# EasyEDA Pro project 2(1).eprj

# Schematic Schematic1
Create Date: 2024-12-19; Page Name: P1; Project Name: 2; Schematic Name: Schematic1; Update Date: 2024-12-19; Company: 嘉立创EDA; Page Size: A4; Version: V1.0
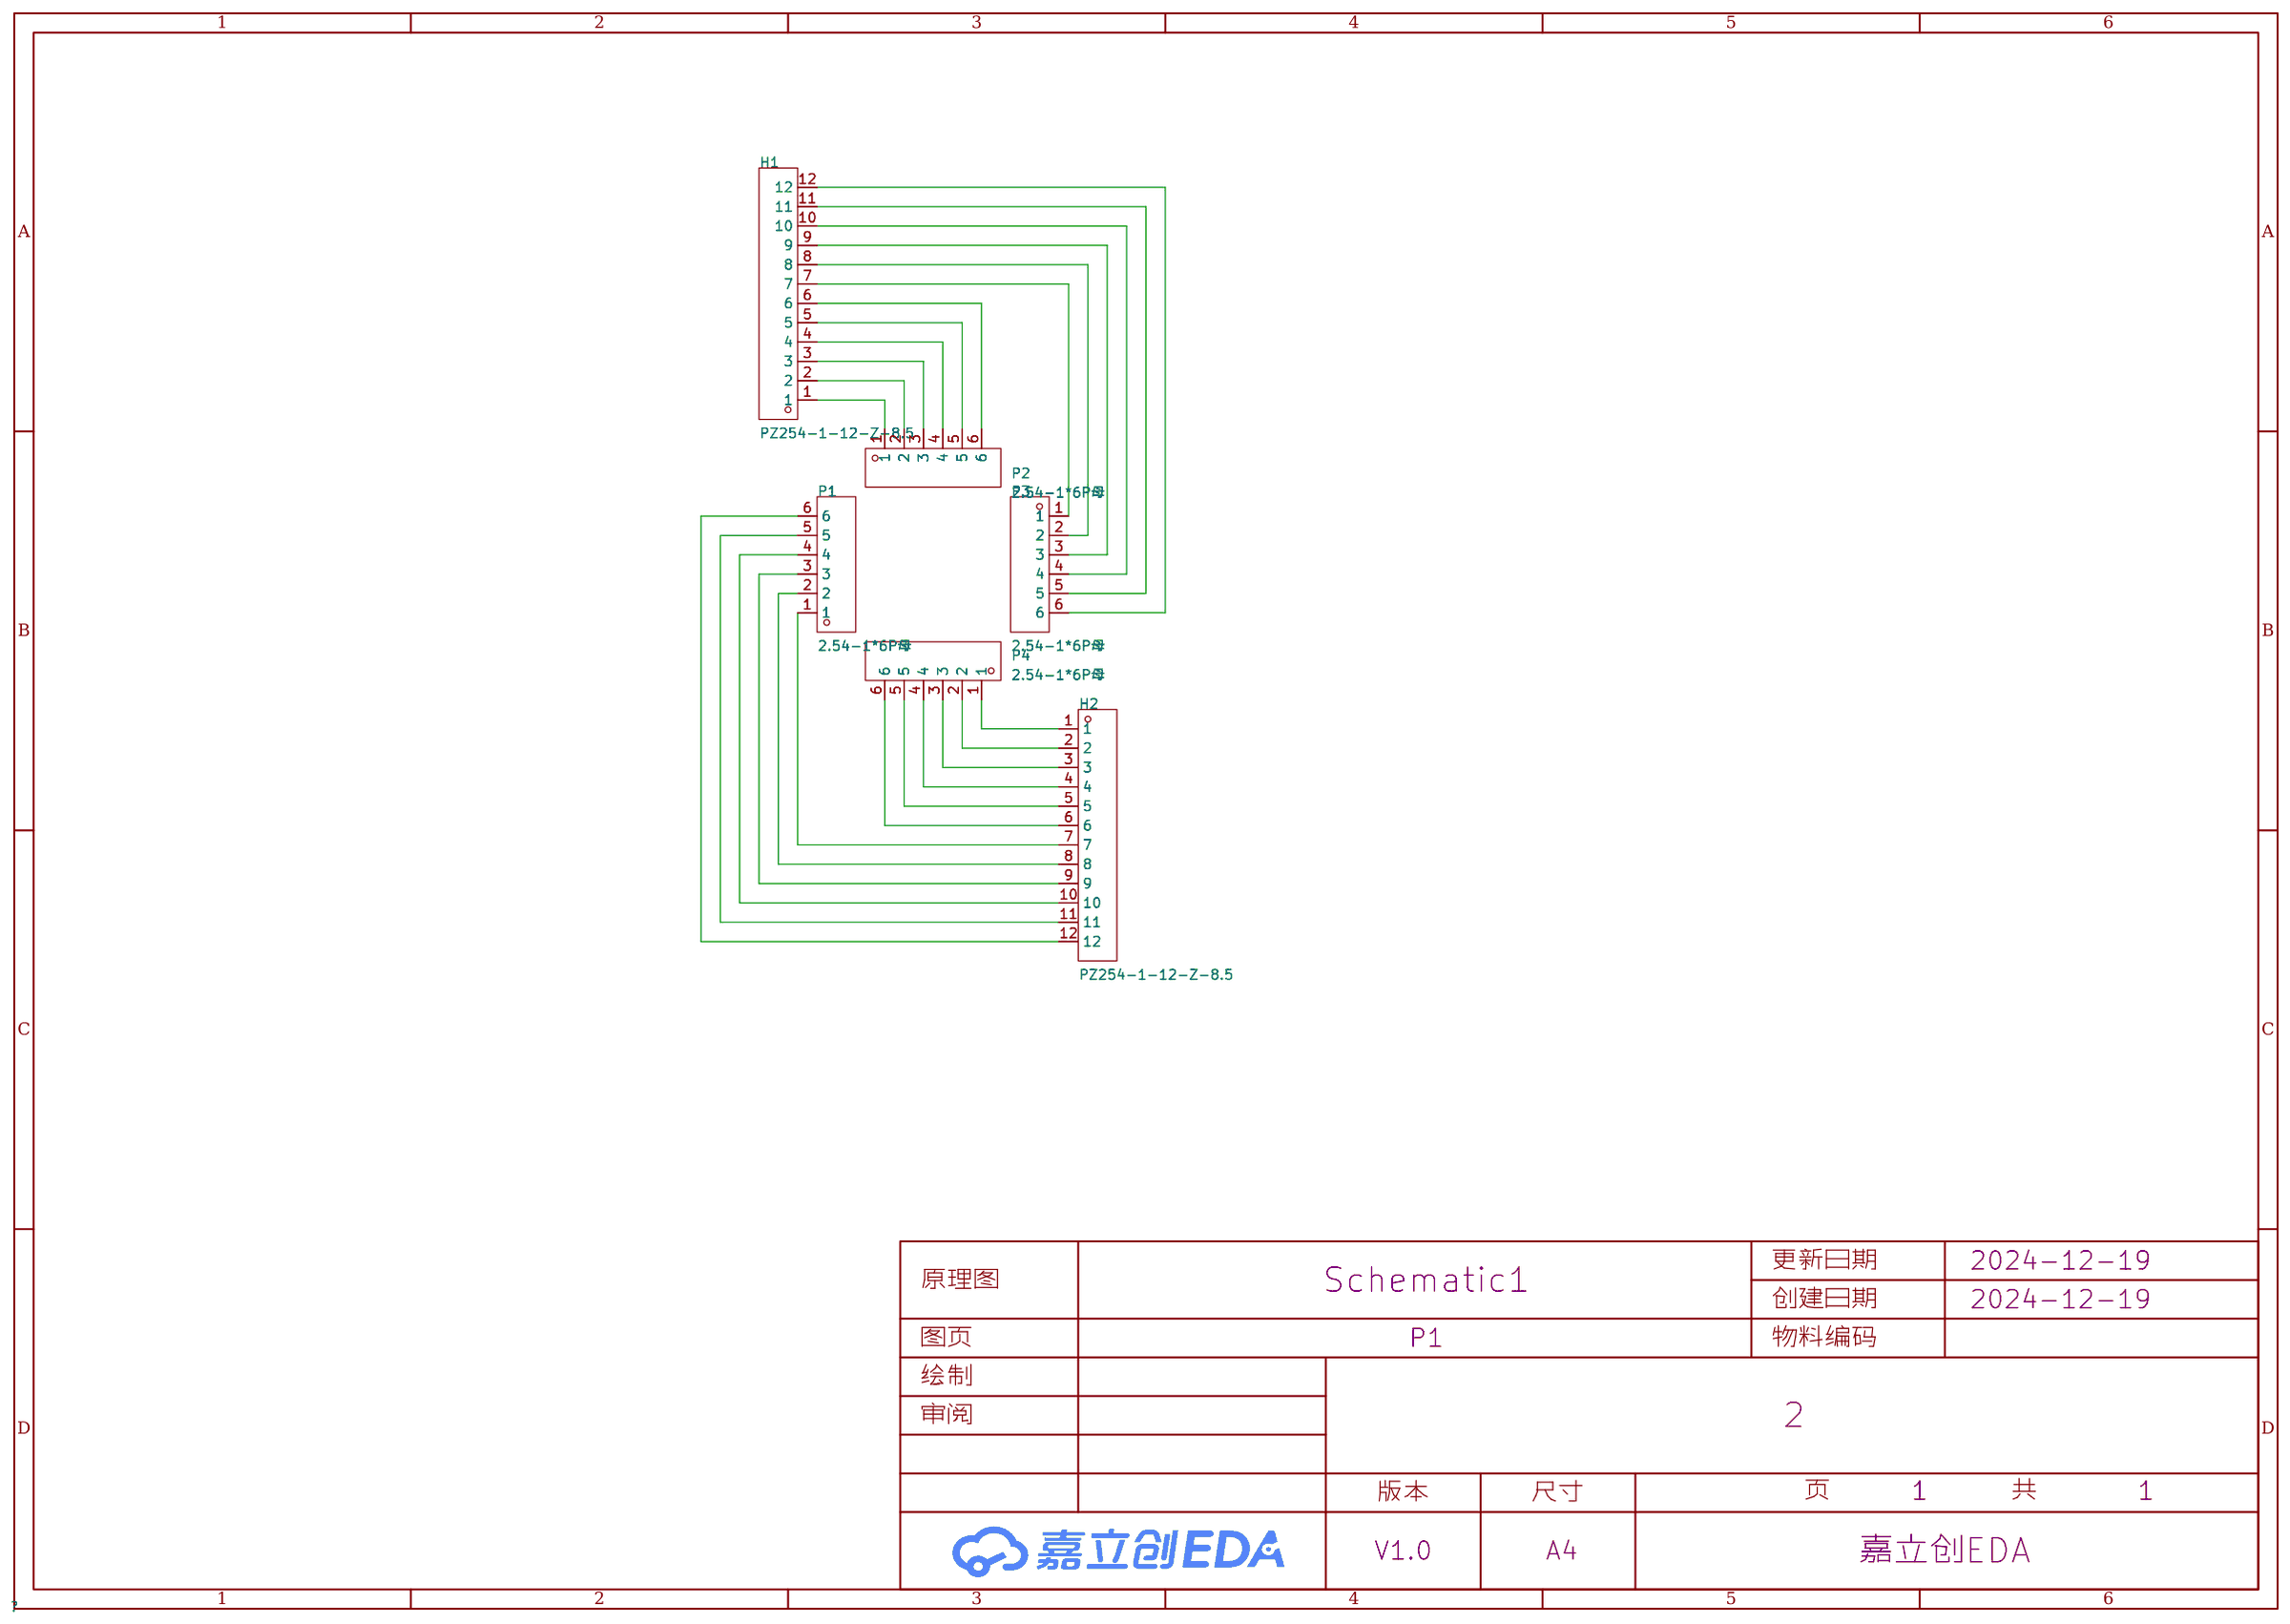
[diagram p0: schematic sheet]

## Parts
H1  PZ254-1-12-Z-8.5  [HDR-TH_12P-P2.54-V-M]
H2  PZ254-1-12-Z-8.5  [HDR-TH_12P-P2.54-V-M]
P1  2.54-1*6P母  [HDR-TH_6P-P2.54-V-F]
P2  2.54-1*6P母  [HDR-TH_6P-P2.54-V-F]
P3  2.54-1*6P母  [HDR-TH_6P-P2.54-V-F]
P4  2.54-1*6P母  [HDR-TH_6P-P2.54-V-F]

## Library data of the parts
H1 H2 = PZ254-1-12-Z-8.5: 插针结构:1x12P;间距:2.54mm;行距:-;圆针/方针:方针;安装类型:直插;排数:单排;总PIN位数:12P;额定电流:3A;额定电压:-;配合针长度:6mm;塑高:2.5mm;端接针长度:3mm;触头材质:黄铜;工作温度范围:-40℃~+105℃;焊接温度(最大值):260℃@10S;颜色:黑色;; LCSC Part Name: 1x12P 间距:2.54mm 方针 直插; Supplier Part: C2894935; Manufacturer: HCTL(华灿天禄); Supplier Footprint: 插件,P=2.54mm; JLCPCB Part Class: 扩展库; Datasheet: https://atta.szlcsc.com/upload/public/pdf/source/20230609/805D25CEF03592837AF6F506EEB5ED41.pdf; Supplier: LCSC; Pin Structure: 1x12P; Pitch: 2.54mm; Circluar Pins/Square Pins: 方针; Mounting Type: 直插; Number of Rows: 单排; Number of Pins: 12P; Current Rating (Max): 3A; Length of Mating Pin: 6mm; Insulation Height: 2.5mm; Length of End Connection Pin: 3mm; Contact Material: 黄铜; Operating Temperature Range: -40℃~+105℃; Soldering Temperature(Max): 260℃@10S; Color: 黑色
P1-P4 = 2.54-1*6P母: 插孔结构:1x6P;间距:2.54mm;行距:-;安装类型:直插;排数:单排;总孔位数:6P;塑高:-;触头材质:-;触头镀层:-;; LCSC Part Name: 间距:2.54mm 1x6P 直插; Supplier Part: C40877; Manufacturer: BOOMELE(博穆精密); Supplier Footprint: 插件,P=2.54mm; JLCPCB Part Class: 扩展库; Datasheet: https://atta.szlcsc.com/upload/public/pdf/source/20210301/C2718488_F4427B881E42CAA8DDB0B1C12B3A522C.pdf; Supplier: LCSC; Holes Structure: 1x6P; Pitch: 2.54mm; Mounting Type: 直插; Number of Rows: 单排; Number of Holes: 6P

## Nets
$1N754: H1.1 P2.1
$1N758: H1.2 P2.2
$1N762: H1.3 P2.3
$1N769: H1.4 P2.4
$1N773: H1.5 P2.5
$1N777: H1.6 P2.6
$1N781: H1.7 P3.1
$1N785: H1.8 P3.2
$1N790: H1.9 P3.3
$1N795: H1.10 P3.4
$1N800: H1.11 P3.5
$1N805: H1.12 P3.6
$1N810: H2.1 P4.1
$1N814: H2.2 P4.2
$1N818: H2.3 P4.3
$1N826: H2.4 P4.4
$1N834: H2.5 P4.5
$1N842: H2.6 P4.6
$1N850: H2.7 P1.1
$1N854: H2.8 P1.2
$1N859: H2.9 P1.3
$1N869: H2.10 P1.4
$1N874: H2.11 P1.5
$1N879: H2.12 P1.6

# Board PCB1
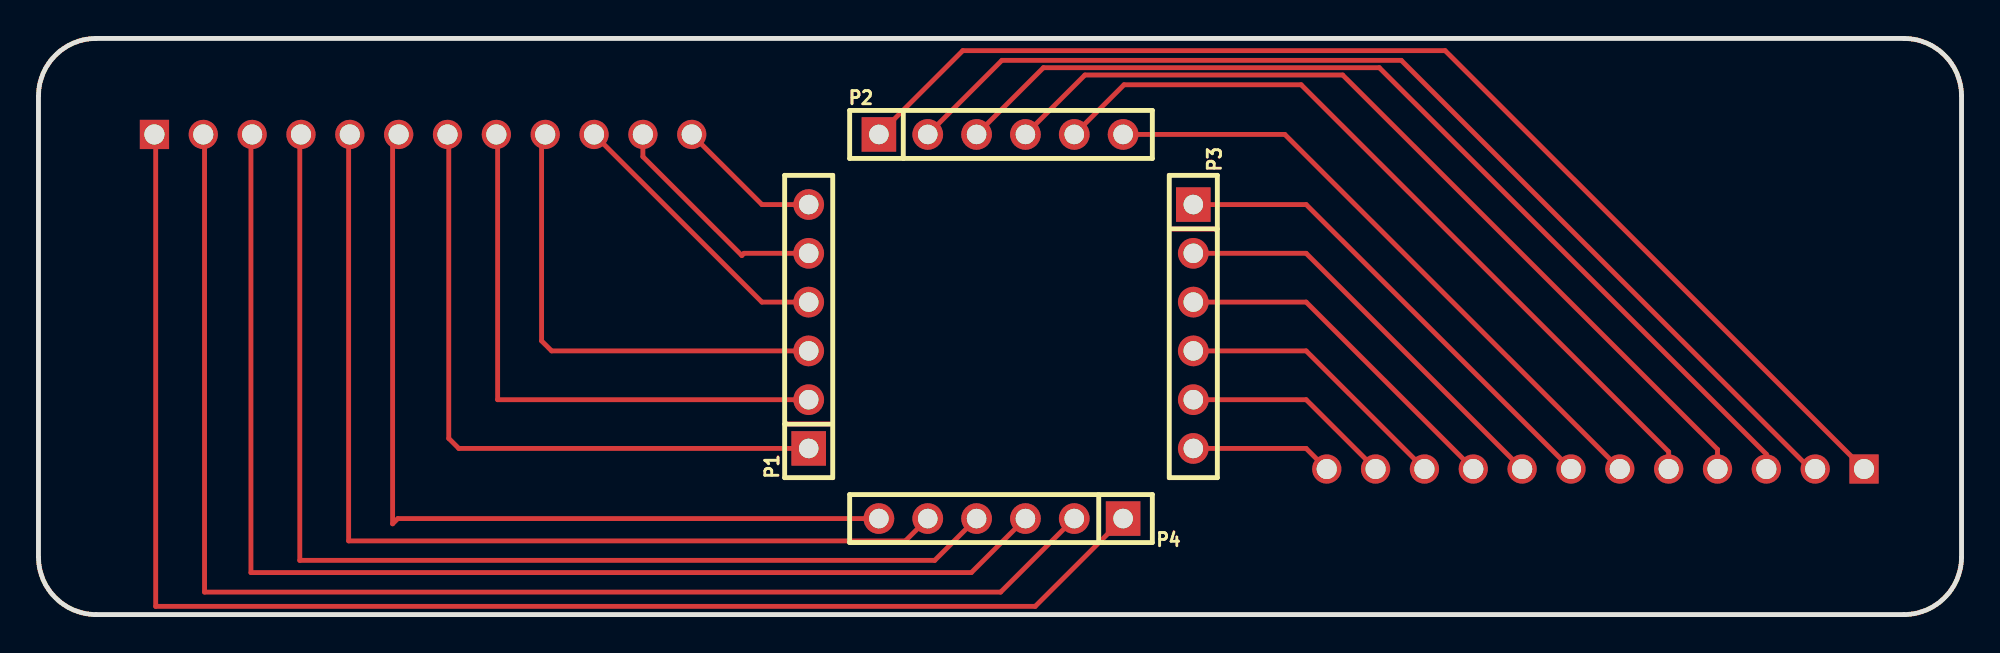
[diagram p1: board, top side]
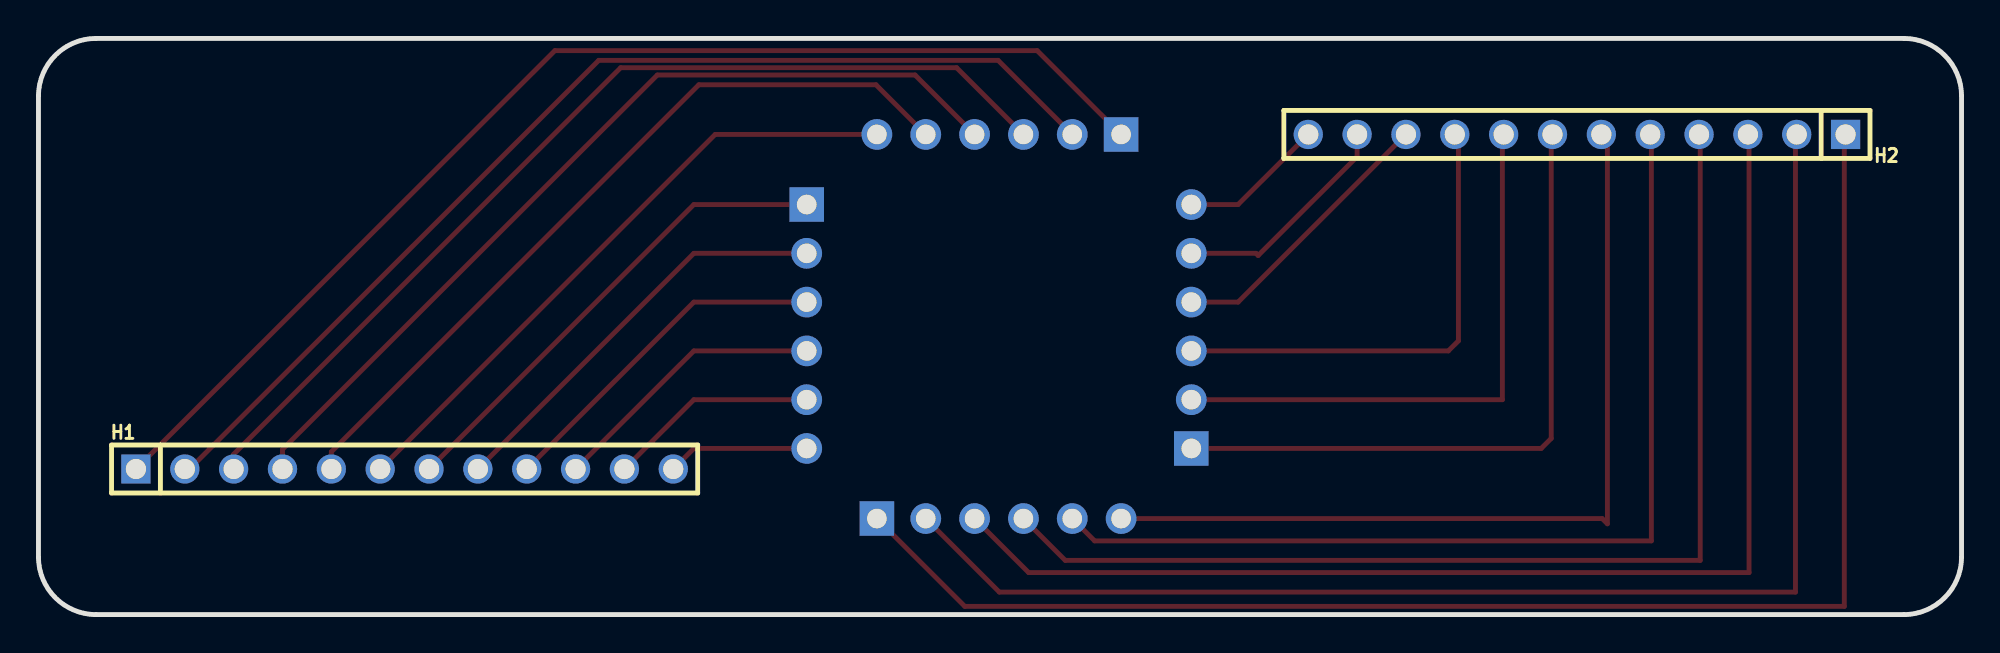
[diagram p2: board, bottom side, seen from below]

Outline 100 x 30 mm; copper layers: Top Layer, Bottom Layer. Coordinates in mm from the lower left corner of the outline.
Outline path: 0,27 0,3 arc(0.88,0.88) 3,0 97,0 arc(99.12,0.88) 100,3 100,27 arc(99.12,29.12) 97,30 3,30 arc(0.88,29.12) 0,27
Stack: Top Layer 0.035mm / Dielectric1 1.51mm FR4 er 4.5 / Bottom Layer 0.035mm

## Design rules (mm)
template: JLCPCB Capability(Two Layers Board)
spacing copperThickness1oz (default): track to track 0.102, other pairs 0.152 to 0.3
spacing copperThickness2oz: track to track 0.203, other pairs 0.152 to 0.3
track width copperThickness1oz (default): min 0.127, default 0.254, max 2.54
track width copperThickness2oz: min 0.203, default 0.254, max 2.54
differential pair differentialPair (default): width min 0.127, default 0.254, max 2.54; gap min 0.152, default 0.152
via viaSize (default): diameter min 0.5, default 0.61, max 10; hole min 0.3, default 0.305, max 6.3

## Placement (name value [footprint] x y rotation side)
H1  PZ254-1-12-Z-8.5  [HDR-TH_12P-P2.54-V-M]  80.96 7.58 180 bottom
H2  PZ254-1-12-Z-8.5  [HDR-TH_12P-P2.54-V-M]  20 25 0 bottom
P1  2.54-1*6P母  [HDR-TH_6P-P2.54-V-F]  40.05 15 90 top
P2  2.54-1*6P母  [HDR-TH_6P-P2.54-V-F]  50.05 25 0 top
P3  2.54-1*6P母  [HDR-TH_6P-P2.54-V-F]  60.05 15 270 top
P4  2.54-1*6P母  [HDR-TH_6P-P2.54-V-F]  50.05 5 180 top

## Footprints (pads in the part's own frame, mm; a bottom-side part is the same pattern mirrored in y, then rotated)
HDR-TH_6P-P2.54-V-F
  rect 1.8x1.8 hole 1.02: 1(-6.35,0)
  round 1.6 hole 1.02: 2(-3.81,0) 3(-1.27,0) 4(1.27,0) 5(3.81,0) 6(6.35,0)
HDR-TH_12P-P2.54-V-M
  rect 1.524x1.524 hole 1.05: 1(-13.97,0)
  round 1.524 hole 1.05: 2(-11.43,0) 3(-8.89,0) 4(-6.35,0) 5(-3.81,0) 6(-1.27,0) 7(1.27,0) 8(3.81,0) 9(6.35,0) 10(8.89,0) 11(11.43,0) 12(13.97,0)

## Nets
As in the schematic.

## Routing (per net, layer and track width the routed paths; a pad name or vN(x,y) marks a point on that pad's centre or on a via; arc(x,y) is an arc through that point)
$1N754: length 62.1
  Top Layer w0.254: H1.1 73.15,29.36 48.07,29.36 P2.1
$1N758: length 56.6
  Top Layer w0.254: H1.2 92.14,7.58 70.87,28.86 50.1,28.86 P2.2
$1N762: length 51.6
  Top Layer w0.254: H1.3 89.85,8.35 69.72,28.48 52.26,28.48 P2.3
$1N769: length 46.4
  Top Layer w0.254: P2.4 54.42,28.09 67.82,28.09 87.31,8.6 H1.4
$1N773: length 40.8
  Top Layer w0.254: H1.5 84.77,8.48 65.66,27.59 56.45,27.59 P2.5
$1N777: length 33
  Top Layer w0.254: P2.6 64.81,25 H1.6
$1N781: length 25.3
  Top Layer w0.254: H1.7 65.92,21.35 P3.1
$1N785: length 21.7
  Top Layer w0.254: H1.8 65.92,18.81 P3.2
$1N790: length 18.2
  Top Layer w0.254: H1.9 65.92,16.27 P3.3
$1N795: length 14.6
  Top Layer w0.254: H1.10 65.92,13.73 P3.4
$1N800: length 11
  Top Layer w0.254: P3.5 65.92,11.19 H1.11
$1N805: length 7.4
  Top Layer w0.254: P3.6 65.92,8.65 H1.12
$1N810: length 76.8
  Top Layer w0.254: H2.1 6.1,24.93 6.1,0.43 51.83,0.43 P4.1
$1N814: length 70.7
  Top Layer w0.254: H2.2 8.64,24.93 8.64,1.17 50.03,1.17 P4.2
$1N818: length 64.3
  Top Layer w0.254: P4.3 48.51,2.19 11.05,2.19 11.05,24.94 H2.3
$1N826: length 58.3
  Top Layer w0.254: H2.4 13.59,24.94 13.59,2.82 46.6,2.82 P4.4
$1N834: length 51.8
  Top Layer w0.254: H2.5 16.13,24.94 16.13,3.84 45.08,3.84 P4.5
$1N842: length 45.8
  Top Layer w0.254: P4.6 18.69,5 18.42,4.73 18.42,24.69 H2.6
$1N850: length 34.8
  Top Layer w0.254: P1.1 21.86,8.65 21.34,9.17 21.34,24.93 H2.7
$1N854: length 30
  Top Layer w0.254: H2.8 23.88,24.93 23.88,11.19 P1.2
$1N859: length 24.9
  Top Layer w0.254: H2.9 26.16,24.81 26.16,14.25 26.68,13.73 P1.3
$1N869: length 14.8
  Top Layer w0.254: P1.4 37.62,16.27 H2.10
$1N874: length 12
  Top Layer w0.254: P1.5 36.69,18.81 36.58,18.7 31.43,23.84 H2.11
$1N879: length 7.6
  Top Layer w0.254: H2.12 37.62,21.35 P1.6
